# EasyEDA schematic SCH_Primaluce-Senso-pcb_2024-02-22.json
TITLE: Sheet_1; REV: 1.0; Date: 2024-02-21; Sheet: 1/1; Drawn By: jrsphoto; Company: Your Company
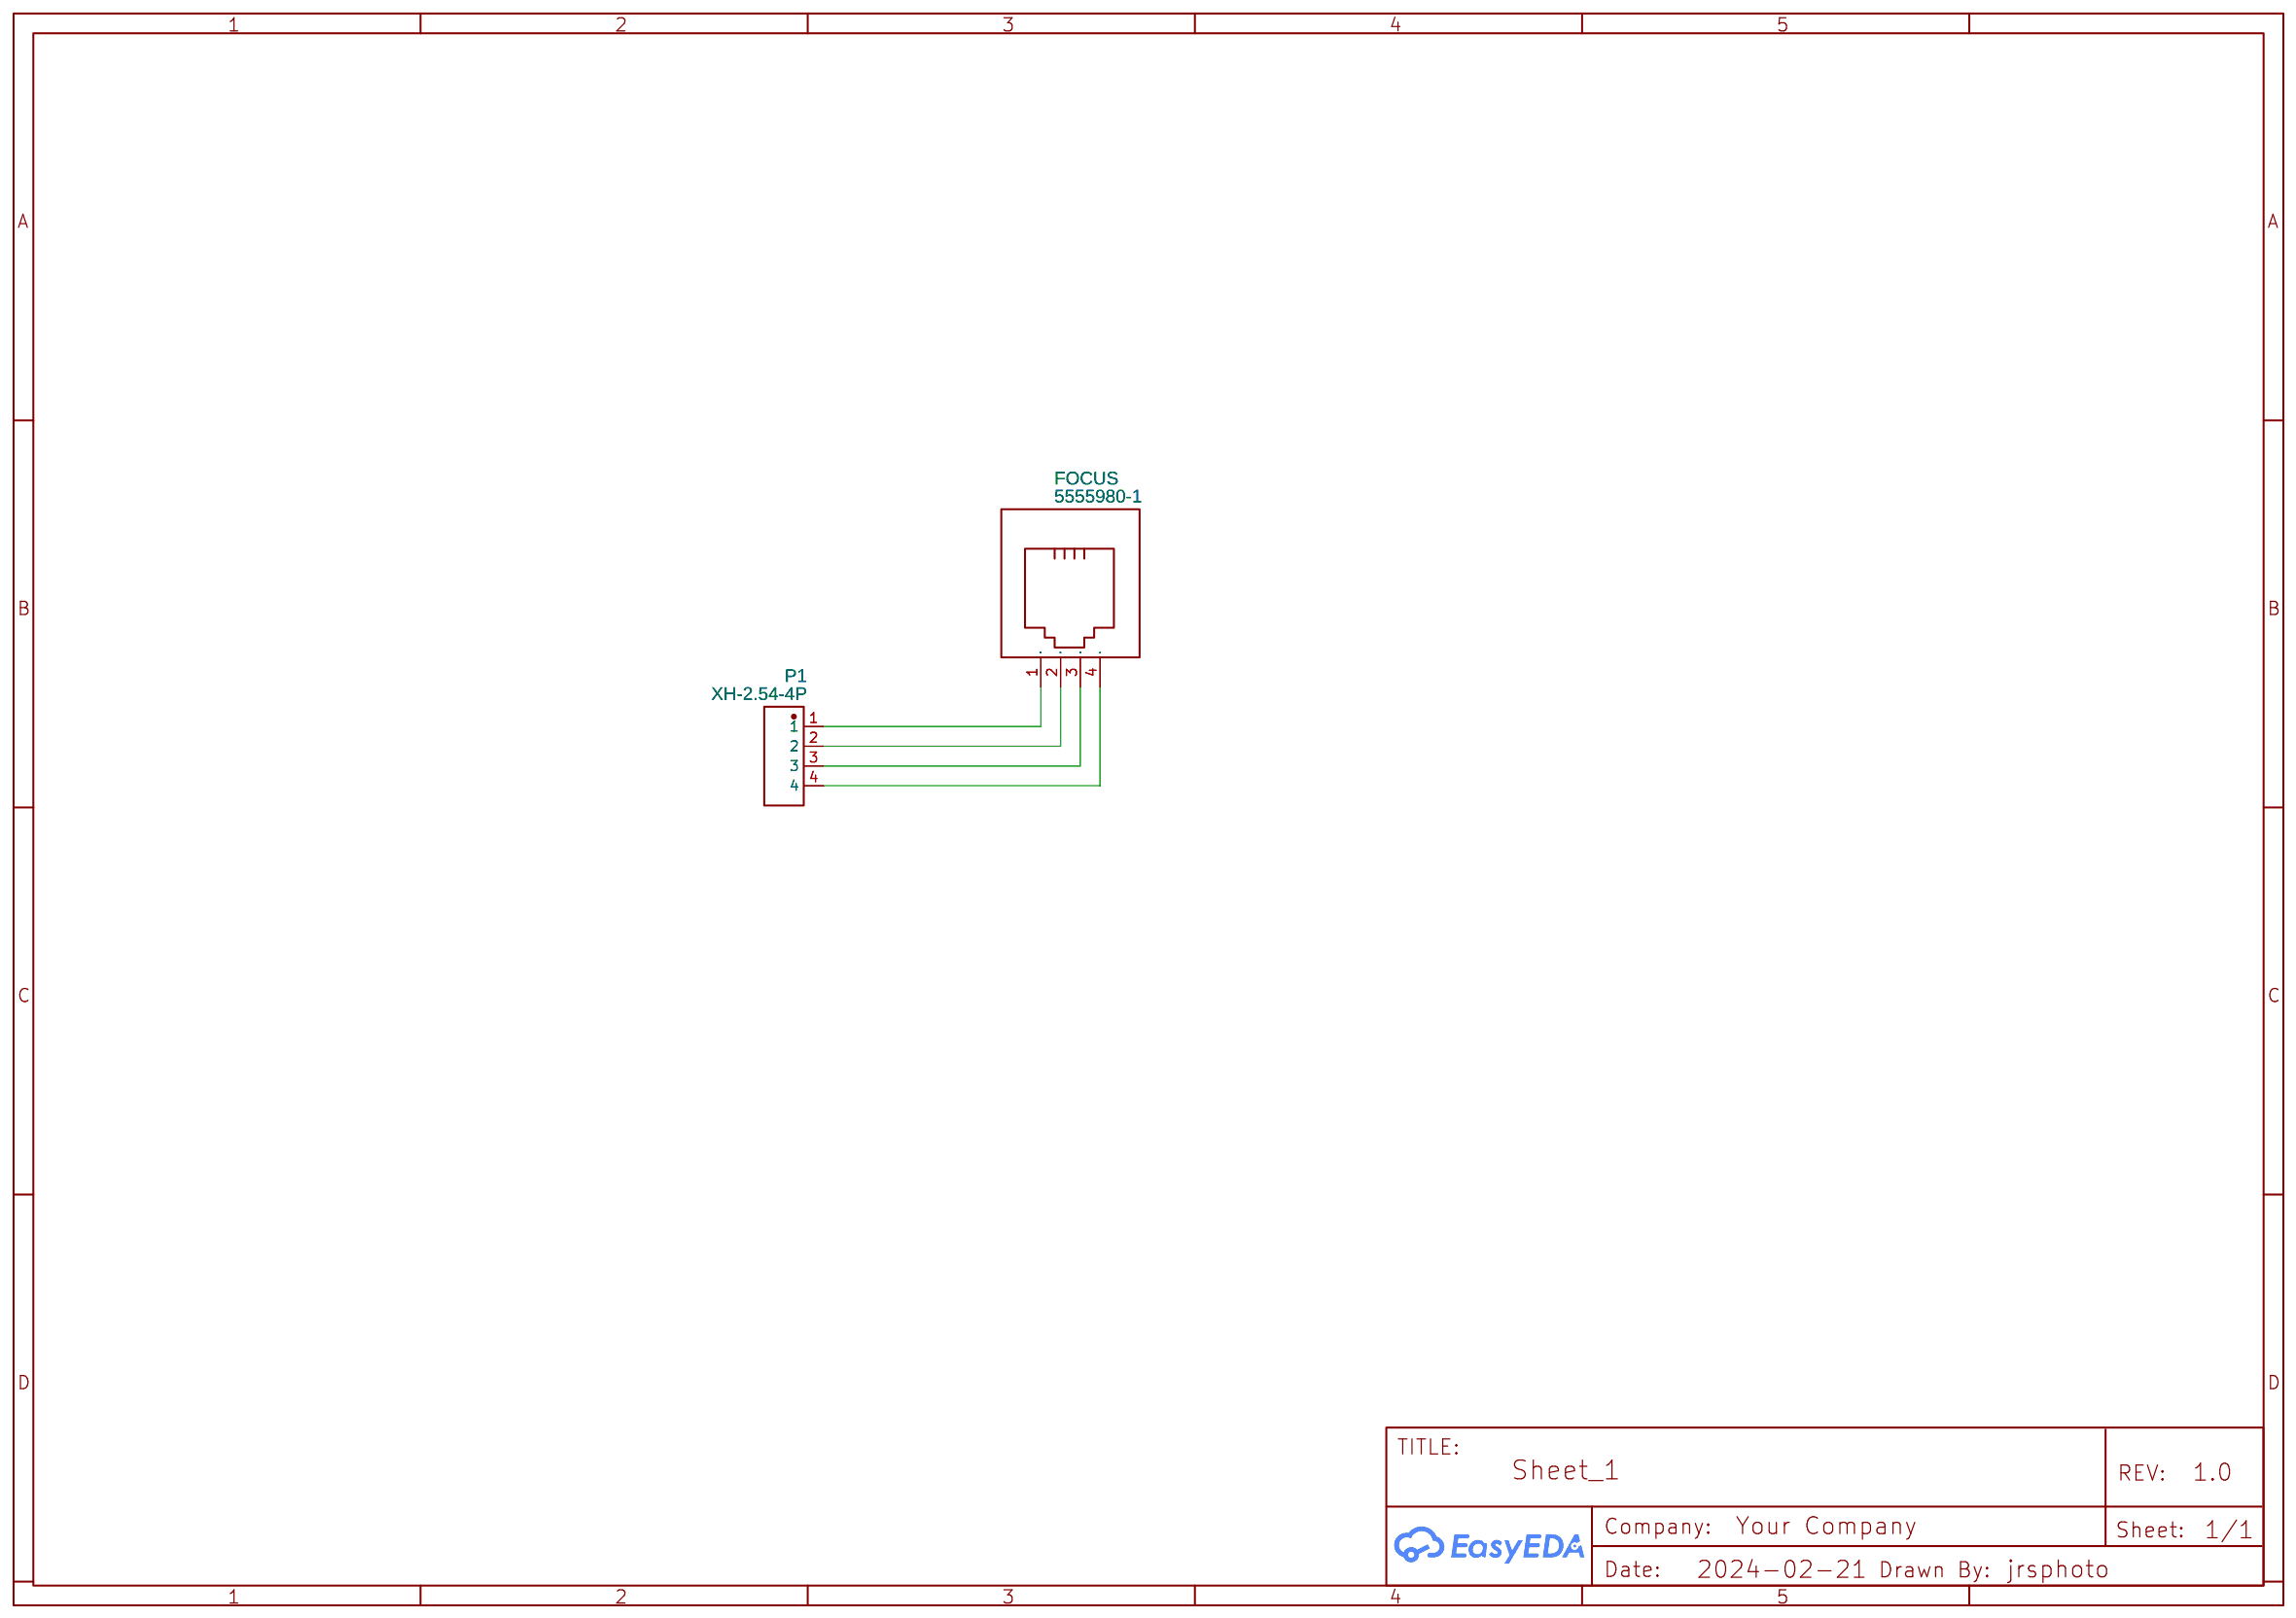
[diagram p0: schematic sheet]

## Parts
FOCUS  5555980-1  [5555980-1]
P1  XH-2.54-4P  [CONN-TH_4P-P2.50-XH2.54-4P]

## Library data of the parts
FOCUS = 5555980-1: Supplier: Mouser; Manufacturer: TE; Contributor: hdutton
P1 = XH-2.54-4P: Contributor: LCSC; Supplier: LCSC; Supplier Part: C9900003933; Manufacturer: null; JLCPCB Part Class: Extended Part

## Nets
Net-(FOCUS-1): FOCUS.1 P1.1
Net-(FOCUS-2): FOCUS.2 P1.2
Net-(FOCUS-3): FOCUS.3 P1.3
Net-(FOCUS-4): FOCUS.4 P1.4
